# EAGLE schematic untitled (Mike Neiderhauser's conflicted copy 2014-12-16) (EAGLE 6.5.0)
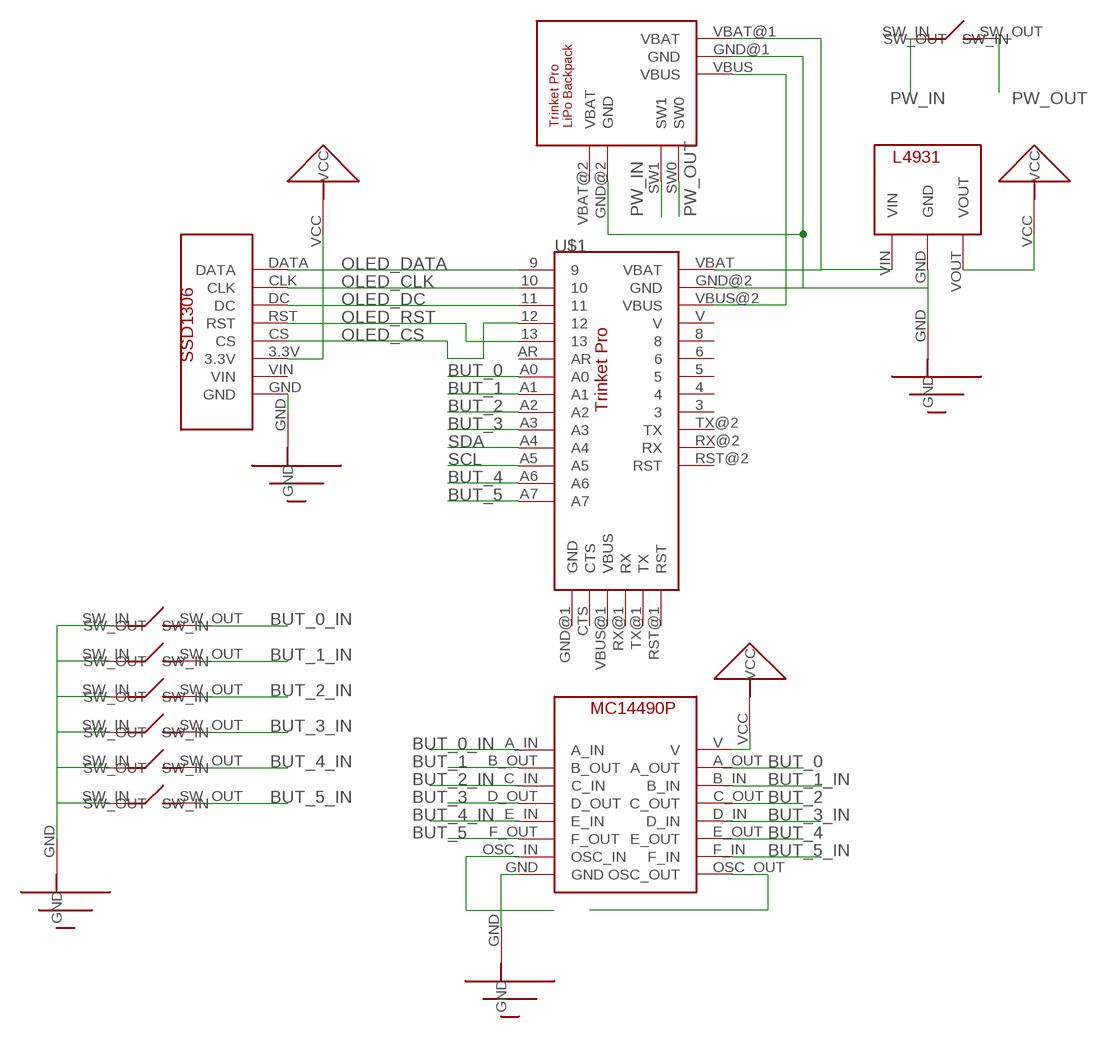
[diagram p0: schematic, sheet 1]

## Parts
U$1  TRINKET_PRO  [TRINKET_PRO]
U$2  SSD1306  [SSD1306]
U$3  TRINKET_PRO_LIPO_BACKPACK  [TRINKET_PRO_LIPO_BACKPACK]
U$4  L4931  [L4931]
U$5  VCC  [VCC]
U$6  VCC  [VCC]
U$7  GND  [GND]
U$8  GND  [GND]
U$9  MC14490P  [MC14490P]
U$10  VCC  [VCC]
U$11  GND  [GND]
U$12  SW  [SW]
U$13  SW  [SW]
U$14  SW  [SW]
U$15  SW  [SW]
U$16  SW  [SW]
U$17  SW  [SW]
U$18  GND  [GND]
U$19  SW  [SW]

## Nets
BUT_0: U$1.A0 U$9.A_OUT
BUT_0_IN: U$9.A_IN U$12.SW_OUT
BUT_1: U$1.A1 U$9.B_OUT
BUT_1_IN: U$9.B_IN U$13.SW_OUT
BUT_2: U$1.A2 U$9.C_OUT
BUT_2_IN: U$9.C_IN U$14.SW_OUT
BUT_3: U$1.A3 U$9.D_OUT
BUT_3_IN: U$9.D_IN U$15.SW_OUT
BUT_4: U$1.A6 U$9.E_OUT
BUT_4_IN: U$9.E_IN U$16.SW_OUT
BUT_5: U$1.A7 U$9.F_OUT
BUT_5_IN: U$9.F_IN U$17.SW_OUT
GND: U$1.GND@2(GND) U$2.GND U$3.GND@1(GND) U$3.GND@2(GND) U$4.GND U$7.GND U$8.GND U$9.GND U$11.GND U$12.SW_IN U$13.SW_IN U$14.SW_IN U$15.SW_IN U$16.SW_IN U$17.SW_IN
N$7: U$9.OSC_IN
N$8: U$9.OSC_OUT
OLED_CLK: U$1.10 U$2.CLK
OLED_CS: U$1.12 U$2.CS
OLED_DATA: U$1.9 U$2.DATA
OLED_DC: U$1.11 U$2.DC
OLED_RST: U$1.13 U$2.RST
PW_IN: U$3.SW1 U$19.SW_IN
PW_OUT: U$3.SW0 U$19.SW_OUT
SCL: U$1.A5
SDA: U$1.A4
VBAT: U$1.VBAT U$3.VBAT@1(VBAT) U$4.VIN
VBUS: U$1.VBUS@2(VBUS) U$3.VBUS
VCC: U$2.3.3V U$4.VOUT U$5.VCC U$6.VCC U$9.V U$10.VCC
Unconnected: U$1.3 U$1.4 U$1.5 U$1.6 U$1.8 U$1.AR U$1.CTS U$1.GND@1(GND) U$1.RST@1(RST) U$1.RST@2(RST) U$1.RX@1(RX) U$1.RX@2(RX) U$1.TX@1(TX) U$1.TX@2(TX) U$1.V U$1.VBUS@1(VBUS) U$2.VIN U$3.VBAT@2(VBAT) U$18.GND

## Library data of the parts
U$1 = workoutAid:TRINKET_PRO
U$2 = workoutAid:SSD1306
U$3 = workoutAid:TRINKET_PRO_LIPO_BACKPACK
U$4 = workoutAid:L4931
U$5 U$6 U$10 = workoutAid:VCC
U$7 U$8 U$11 U$18 = workoutAid:GND
U$9 = workoutAid:MC14490P
U$12-U$17 U$19 = workoutAid:SW